# Altium schematic sheet IO_Extension.SchDoc
size A4; SheetNumber: 5; SheetTotal: 6
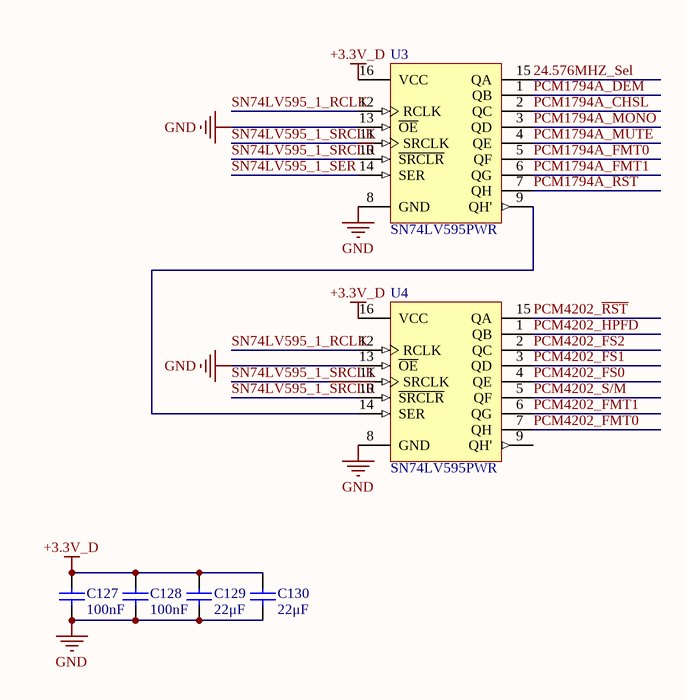
[diagram p0: IO_Extension.SchDoc]

## Parts
C127  100nF  [C 0402_L]
C128  100nF  [C 0402_L]
C129  22μF  [0805_C]
C130  22μF  [0805_C]
U3  SN74LV595PWR  [PW0016A_L]
U4  SN74LV595PWR  [PW0016A_L]

## Nets
+3.3V_D: C127.1 C128.1 C129.1 C130.1 U3.16(VCC) U4.16(VCC)
GND: C127.2 C128.2 C129.2 C130.2 U3.8(GND) U3.13(~{OE}) U4.8(GND) U4.13(~{OE})
24.576MHZ_Sel: U3.15(QA)
PCM1794A_CHSL: U3.2(QC)
PCM1794A_DEM: U3.1(QB)
PCM1794A_FMT0: U3.5(QF)
PCM1794A_FMT1: U3.6(QG)
PCM1794A_MONO: U3.3(QD)
PCM1794A_MUTE: U3.4(QE)
PCM1794A_~{RST}: U3.7(QH)
PCM4202_FMT0: U4.7(QH)
PCM4202_FMT1: U4.6(QG)
PCM4202_FS0: U4.4(QE)
PCM4202_FS1: U4.3(QD)
PCM4202_FS2: U4.2(QC)
PCM4202_HPFD: U4.1(QB)
PCM4202_~{RST}: U4.15(QA)
PCM4202_S/~{M}: U4.5(QF)
SN74LV595_1_RCLK: U3.12(RCLK) U4.12(RCLK)
SN74LV595_1_~{SRCLR}: U3.10(~{SRCLR}) U4.10(~{SRCLR})
SN74LV595_1_SER: U3.14(SER)
SN74LV595_1_SRCLK: U3.11(SRCLK) U4.11(SRCLK)
NetU3_9: U3.9(QH') U4.14(SER)

Not connected (* = marked no-connect by the designer): U4 9(QH')

## Library data of the parts
C127-C130 = Cap: Capacitor; Value: 10uF; Published: 8-Jun-2000; LatestRevisionDate: 17-Jul-2002; LatestRevisionNote: Re-released for DXP Platform.; PackageReference: RAD-0.3; Publisher: Altium Limited; PackageDescription: Radial Cap, Thru-Hole; 2 Leads; 0.3 in Pin Spacing
U3 U4 = CMP-0807-00193-3: 8-Bit Shift Registers With 3-State Output Registers, PW0016A, LARGE T&R; Generic Part Number: SN74AHC595; Manufacturer: Texas Instruments; Output Drive (IOL/IOH)(Max)(mA): 50/-50; Output Type: CMOS; VCC(Max)(V): 5.5; F @ Nom Voltage(Max)(Mhz): 110; Voltage(Nom)(V): 3.3, 5; Technology Family: AHC; tpd @ Nom Voltage(Max)(ns): 20, 11.4; 3-State Output: Yes; Rating: Catalog; VCC(Min)(V): 2; ICC @ Nom Voltage(Max)(mA): 0.04; Bits: 8; DatasheetVersion: SCLS373J; Operating Temperature Range(C): -40 to 125; PackageReference: PW0016A; Code_JEDEC: MO-153; PackageVersion: http://www.ti.com/lit/ml/mpds361/mpds361.pdf; Input Type: CMOS